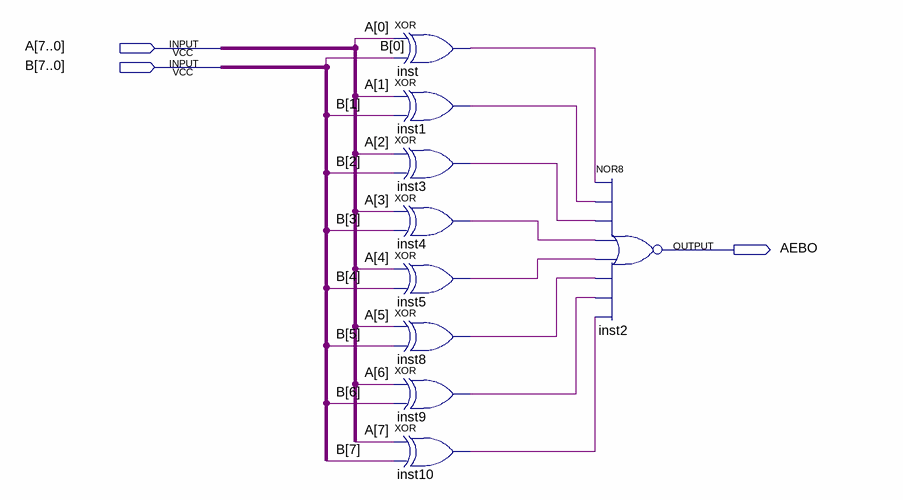
[diagram p0: schematic sheet]
// Quartus schematic Equal8.bdf as structural Verilog: 9 symbols, 3 pins
module Equal8 (
  input  [7:0] A,
  input  [7:0] B,
  output AEBO
);

  wire inst1_out, inst3_out, inst4_out, inst5_out, inst8_out, inst9_out, inst10_out, inst_out;

  xor inst (inst_out, A[0], B[0]);
  xor inst1 (inst1_out, A[1], B[1]);
  xor inst3 (inst3_out, A[2], B[2]);
  xor inst4 (inst4_out, A[3], B[3]);
  xor inst5 (inst5_out, A[4], B[4]);
  xor inst8 (inst8_out, A[5], B[5]);
  xor inst9 (inst9_out, A[6], B[6]);
  xor inst10 (inst10_out, A[7], B[7]);
  nor inst2 (AEBO, inst_out, inst1_out, inst3_out, inst4_out, inst5_out, inst8_out, inst9_out, inst10_out);
endmodule
